# EAGLE design USB_IF_STM_Lpt_v3 (EAGLE 7.1.0)
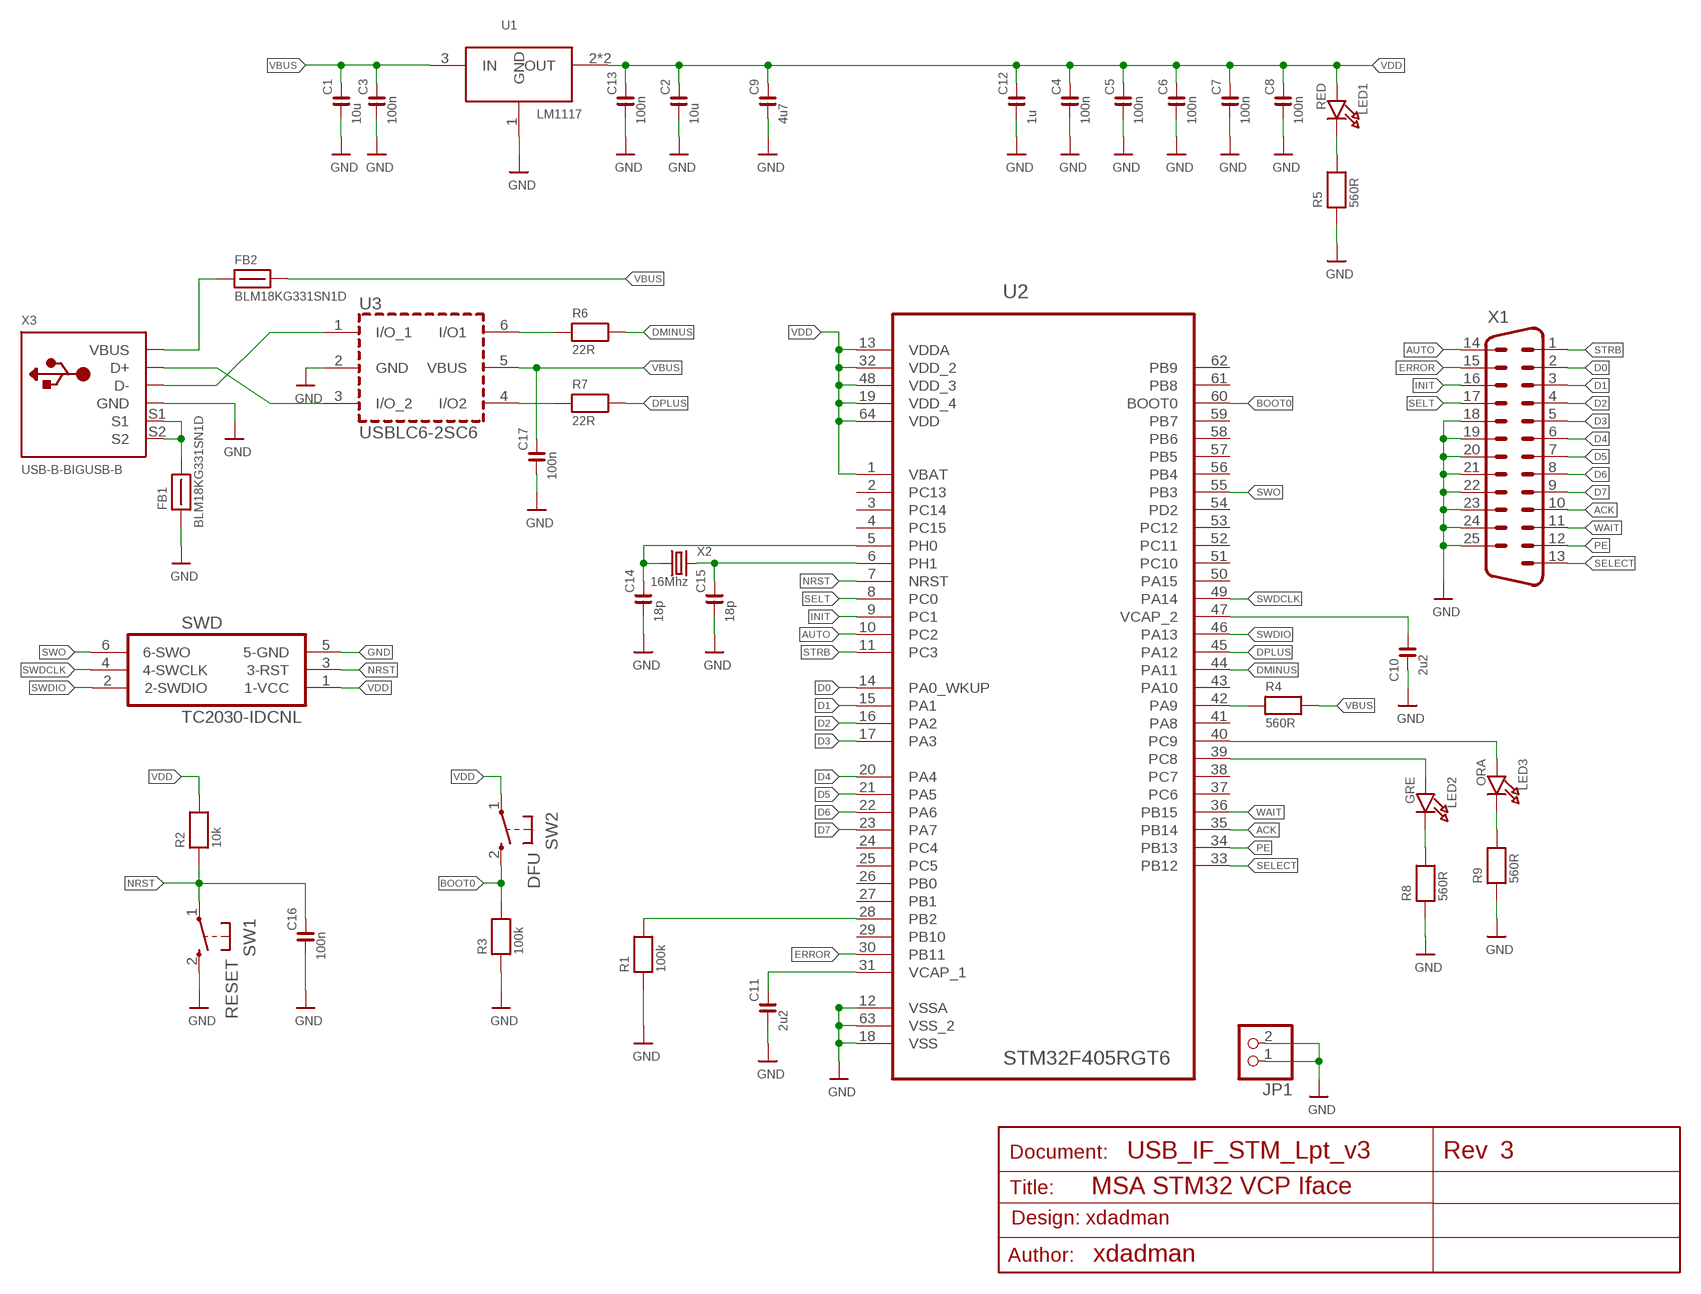
[diagram p0: schematic, sheet 1]

## Parts
C1  10u  CC120610U  [C1206]
C2  10u  CC120610U  [C1206]
C3  100n  CC0603100NF  [C0603]
C4  100n  CC0603100NF  [C0603]
C5  100n  CC0603100NF  [C0603]
C6  100n  CC0603100NF  [C0603]
C7  100n  CC0603100NF  [C0603]
C8  100n  CC0603100NF  [C0603]
C9  4u7  CC06034U7  [C0603]
C10  2u2  CC06032U2  [C0603]
C11  2u2  CC06032U2  [C0603]
C12  1u  CC06031UF  [C0603]
C13  100n  CC0603100NF  [C0603]
C14  18p  CC060318PF  [C0603]
C15  18p  CC060318PF  [C0603]
C16  100n  CC0603100NF  [C0603]
C17  100n  CC0603100NF  [C0603]
FB1  BLM18KG331SN1D  FBEAD0603BLM18KG331SN1D  [R0603]
FB2  BLM18KG331SN1D  FBEAD0603BLM18KG331SN1D  [R0603]
JP1  PINHD-1X2  [1X02]
LED1  RED  LED_0603_RED0603  [CHIPLED_0603]
LED2  GRE  LED_0603_GRE0603  [CHIPLED_0603]
LED3  ORA  LED_0603_YEL0603  [CHIPLED_0603]
R1  100k  R0603100K  [R0603]
R2  10k  R060310K  [0603-MINI]
R3  100k  R0603100K  [R0603]
R4  560R  R0603560R  [R0603]
R5  560R  R0603560R  [R0603]
R6  22R  R060322R  [R0603]
R7  22R  R060322R  [R0603]
R8  560R  R0603560R  [R0603]
R9  560R  R0603560R  [R0603]
SW1  RESET  TACTILE_SWITCH_R6X3  [TACTILE_6X3]
SW2  DFU  TACTILE_SWITCH_R6X3  [TACTILE_6X3]
SWD  TC2030-IDCNL  [TC2030-IDC-NL]
U1  LM1117  [SOT223]
U2  STM32F405RGT6  [QFP50P1200X1200X160-64N]
U3  USBLC6-2SC6  [SOT-23-6L]
X1  M25D  [M25D]
X2  16Mhz  ABM7-16MHZ  [ABRACON_ABM7]
X3  USB-B-BIGUSB-B  [USB-B-PTH]

## Nets
ACK: U2.35(PB14) X1.10
AUTO: U2.10(PC2) X1.14
BOOT0: R3.2 SW2.2 U2.60(BOOT0)
D0: U2.14(PA0_WKUP) X1.2
D1: U2.15(PA1) X1.3
D2: U2.16(PA2) X1.4
D3: U2.17(PA3) X1.5
D4: U2.20(PA4) X1.6
D5: U2.21(PA5) X1.7
D6: U2.22(PA6) X1.8
D7: U2.23(PA7) X1.9
DMINUS: R6.2 U2.44(PA11)
DPLUS: R7.2 U2.45(PA12)
ERROR: U2.30(PB11) X1.15
GND: C1.1 C2.1 C3.1 C4.1 C5.1 C6.1 C7.1 C8.1 C9.1 C10.1 C11.1 C12.1 C13.1 C14.1 C15.1 C16.1 C17.1 FB1.1 JP1.1 JP1.2 R1.1 R3.1 R5.1 R8.1 R9.1 SW1.2 SWD.5(5-GND) U1.1(GND) U2.12(VSSA) U2.18(VSS) U2.63(VSS_2) U3.2(GND) X1.18 X1.19 X1.20 X1.21 X1.22 X1.23 X1.24 X1.25 X3.GND
INIT: U2.9(PC1) X1.16
N$1: R1.2 U2.28(PB2)
N$2: R4.1 U2.42(PA9)
N$3: LED1.C R5.2
N$5: C11.2 U2.31(VCAP_1)
N$6: C15.2 U2.6(PH1) X2.P$2
N$7: C14.2 U2.5(PH0) X2.P$1
N$8: FB1.2 X3.S1 X3.S2
N$9: FB2.1 X3.VBUS
N$10: U3.3(I/O_2) X3.D+
N$11: U3.1(I/O_1) X3.D-
N$12: R6.1 U3.6(I/O1)
N$13: R7.1 U3.4(I/O2)
N$14: C10.2 U2.47(VCAP_2)
N$15: LED2.C R8.2
N$16: LED3.C R9.2
NRST: C16.2 R2.1 SW1.1 SWD.3(3-RST) U2.7(NRST)
PE: U2.34(PB13) X1.12
SELECT: U2.33(PB12) X1.13
SELT: U2.8(PC0) X1.17
STRB: U2.11(PC3) X1.1
SWDCLK: SWD.4(4-SWCLK) U2.49(PA14)
SWDIO: SWD.2(2-SWDIO) U2.46(PA13)
SWO: SWD.6(6-SWO) U2.55(PB3)
VBUS: C1.2 C3.2 C17.2 FB2.2 R4.2 U1.3(IN) U3.5(VBUS)
VDD: C2.2 C4.2 C5.2 C6.2 C7.2 C8.2 C9.2 C12.2 C13.2 LED1.A R2.2 SW2.1 SWD.1(1-VCC) U1.2(OUT) U1.4(OUT) U2.1(VBAT) U2.13(VDDA) U2.19(VDD_4) U2.32(VDD_2) U2.48(VDD_3) U2.64(VDD)
VDD1: LED2.A U2.39(PC8)
VDD2: LED3.A U2.40(PC9)
WAIT: U2.36(PB15) X1.11
Unconnected: U2.2(PC13) U2.3(PC14) U2.4(PC15) U2.24(PC4) U2.25(PC5) U2.26(PB0) U2.27(PB1) U2.29(PB10) U2.37(PC6) U2.38(PC7) U2.41(PA8) U2.43(PA10) U2.50(PA15) U2.51(PC10) U2.52(PC11) U2.53(PC12) U2.54(PD2) U2.56(PB4) U2.57(PB5) U2.58(PB6) U2.59(PB7) U2.61(PB8) U2.62(PB9)

## Notes on the sheet
- 3
- MSA STM32 VCP Iface
- Design: xdadman
- xdadman

## Library data of the parts
C1 C2 = MSA_lib:CC1206: Capacitor ceramic 1206; OC_FARNELL: 1611967
C3-C8 C13 C16 C17 = MSA_lib:CC0603: 0603 Ceramic capacitor; OC_FARNELL: 1759016
C9 = MSA_lib:CC0603: 0603 Ceramic capacitor; OC_FARNELL: 1735527
C10 C11 = MSA_lib:CC0603: 0603 Ceramic capacitor; OC_FARNELL: 1797012
C12 = MSA_lib:CC0603: 0603 Ceramic capacitor; OC_FARNELL: 1845766
C14 C15 = MSA_lib:CC0603: 0603 Ceramic capacitor; OC_FARNELL: 1828908
FB1 FB2 = MSA_lib:FBEAD0603: Ferrite bead; OC_FARNELL: 1781092
JP1 = MSA_lib:PINHD-1X2: PIN HEADER
LED1 = MSA_lib:LED_0603_RED: Chip LED 0603 RED 2ma; OC_FARNELL: 1685068
LED2 = MSA_lib:LED_0603_GRE: Chipled 0603 GREEN 2ma; OC_FARNELL: 1908053
LED3 = MSA_lib:LED_0603_YEL: Chipled 0603 yellow 2ma; OC_FARNELL: 1685069
R1 R3 = MSA_lib:R0603: Resistor 0603; OC_FARNELL: 2332029
R2 = MSA_lib:R0603: Resistor 0603; OC_FARNELL: 9330399
R4 R5 R8 R9 = MSA_lib:R0603: Resistor 0603; OC_FARNELL: 2331724
R6 R7 = MSA_lib:R0603: Resistor 0603; OC_FARNELL: 2331703
SW1 SW2 = MSA_lib:TACTILE_SWITCH_R: Tactile switch RA 6mm; GME_OC: 630-168
SWD = MSA_lib:TC2030-IDC: Tag-Connect In Circuit Programming & Debug Cable 6 Pin http://www.tag-connect.com
U1 = MSA_lib:LM1117: LDO 3.3V LM1117; OC_FARNELL: 2323580
U2 = MSA_lib:STM32F405RGT6: IC, MCU, 32BIT, 1MB FLASH, 64LQFP; MPN: STM32F405RGT6; OC_FARNELL: 2064363; OC_NEWARK: 73T2329; PACKAGE: 64LQFP; SUPPLIER: STMicroelectronics
U3 = MSA_lib:USBLC6-2: VERY LOW CAPACITANCE ESD PROTECTION 2 line Datasheet link <http://www.st.com/web/catalog/sense_power/FM114/CL1137/SC1489/PF93353>; OC_FARNELL: 1269406
X1 = MSA_lib:M25: SUB-D; OC_FARNELL: 1084674
X2 = MSA_lib:ABM7-16MHZ: Crystal 16mhz; OC_FARNELL: 2308713
X3 = MSA_lib:USB-B-BIG; OC_FARNELL: 2112373

## Board
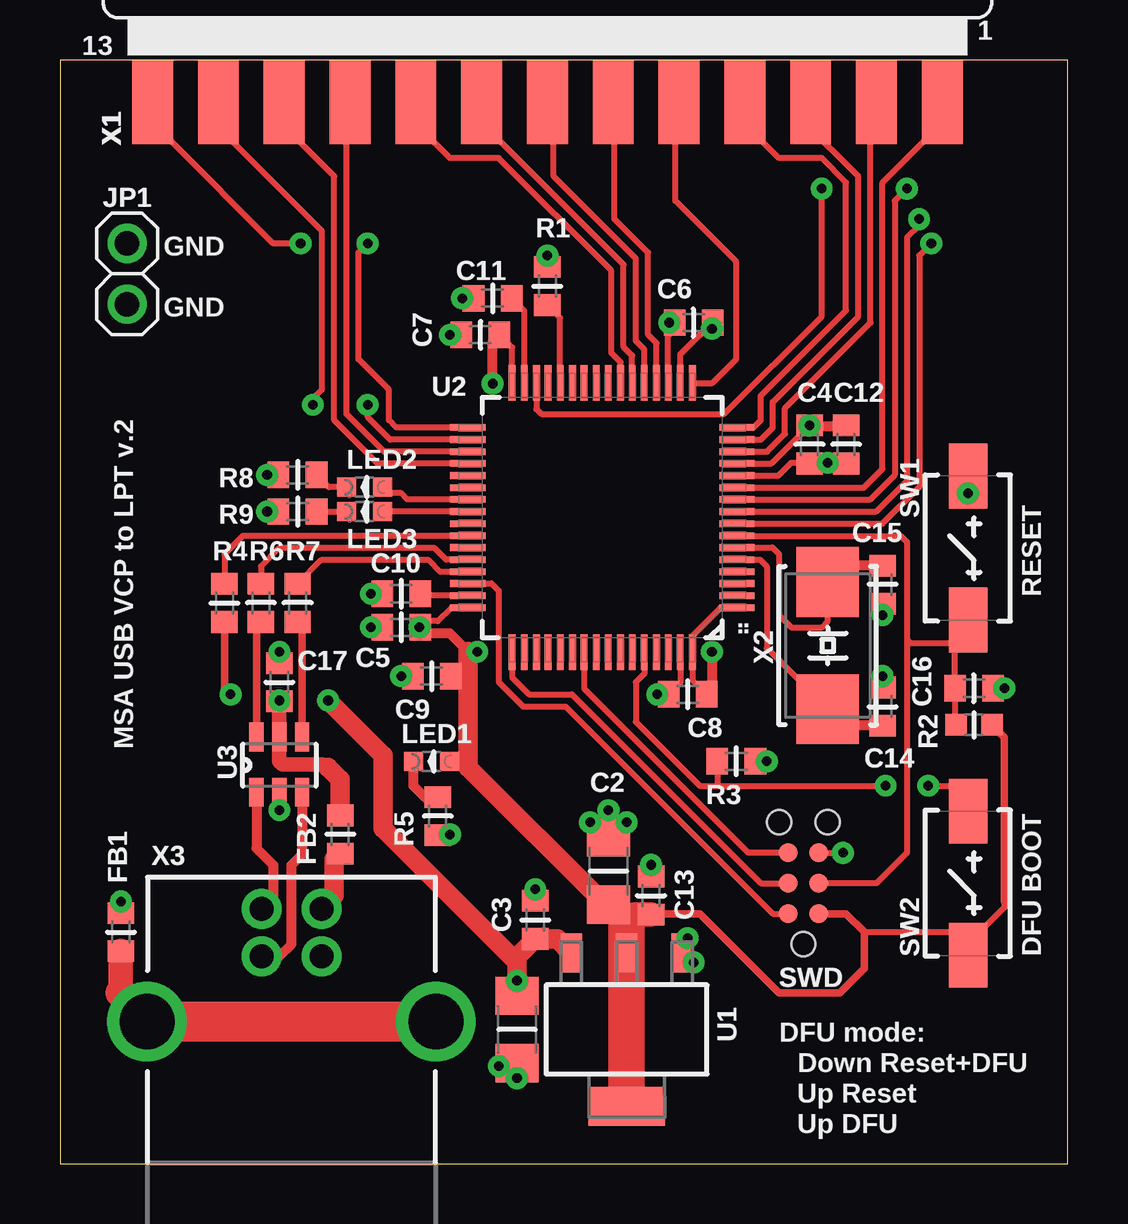
[diagram p1: board, top side]
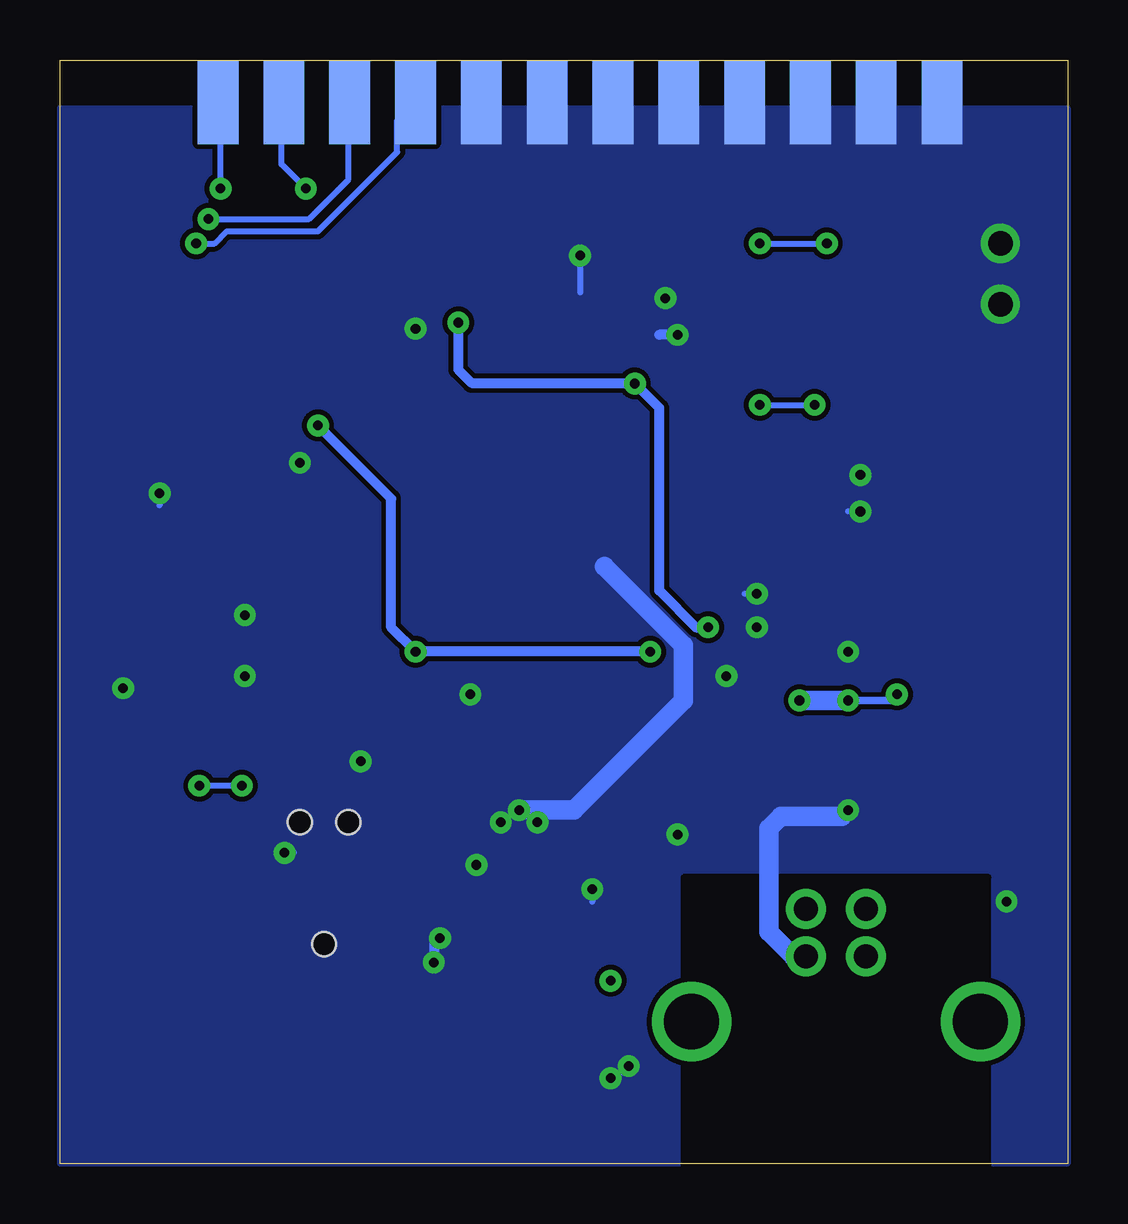
[diagram p2: board, bottom side, seen from below]

Size 42 x 46 mm. Coordinates in mm from the lower left corner, seen from the top.
Outline: 0,0 42,0 42,46 0,46 0,0
Copper layers (1*16): Top 0.035mm / dielectric 1.5mm / Bottom 0.035mm
Design rules "kuba_no_CLR": minimum track width 8mil, minimum drill 15mil, track to track 8mil, track to pad 8mil, pad to pad 8mil, via to via 8mil, smd to smd 8mil, copper to edge 0mil, drill to drill 8mil, minimum pad ring 12mil, minimum via ring 10mil, stop-mask expansion 4mil, vias tented up to drill 0mil, thermal gap 10mil

### Footprints (pad centres in the part's own frame; a part is rotated, then mirrored left to right if it is on the bottom)
C1206 = smd 1.6 x 1.8: 1 -1.4,0; 2 1.4,0
C0603 = smd 0.9 x 1.1: 1 -0.794,0; 2 0.794,0
R0603 = smd 0.9 x 1.1: 1 -0.794,0; 2 0.794,0
1X02 = drill 1.016: 1 -1.27,0; 2 1.27,0
CHIPLED_0603 = smd 0.8 x 0.8: A 0,-0.75; C 0,0.75
0603-MINI = smd 0.9 x 0.9: 1 -0.75,0; 2 0.75,0
TACTILE_6X3 = smd 2.7 x 1.6: 1 -3,0; 2 3,0
TC2030-IDC-NL = smd 0.787 x 0.787: 1 -1.27,-0.635; 2 -1.27,0.635; 3 0,-0.635; 4 0,0.635; 5 1.27,-0.635; 6 1.27,0.635 | hole 1: -2.54,0; 2.54,1.016; 2.54,-1.016
SOT223 = smd 1.626 x 0.889: 1 -3.2,2.311; 2 -3.2,0; 3 -3.2,-2.311 | smd 1.626 x 3.175: 4 3.2,0
QFP50P1200X1200X160-64N = smd 1.473 x 0.279: 1 -5.613,3.759; 2 -5.613,3.251; 3 -5.613,2.743; 4 -5.613,2.261; 5 -5.613,1.753; 6 -5.613,1.245; 7 -5.613,0.762; 8 -5.613,0.254; 9 -5.613,-0.254; 10 -5.613,-0.762; 11 -5.613,-1.245; 12 -5.613,-1.753; 13 -5.613,-2.261; 14 -5.613,-2.743; 15 -5.613,-3.251; 16 -5.613,-3.759; 33 5.613,-3.759; 34 5.613,-3.251; 35 5.613,-2.743; 36 5.613,-2.261; 37 5.613,-1.753; 38 5.613,-1.245; 39 5.613,-0.762; 40 5.613,-0.254; 41 5.613,0.254; 42 5.613,0.762; 43 5.613,1.245; 44 5.613,1.753; 45 5.613,2.261; 46 5.613,2.743; 47 5.613,3.251; 48 5.613,3.759 | smd 0.279 x 1.473: 17 -3.759,-5.613; 18 -3.251,-5.613; 19 -2.743,-5.613; 20 -2.261,-5.613; 21 -1.753,-5.613; 22 -1.245,-5.613; 23 -0.762,-5.613; 24 -0.254,-5.613; 25 0.254,-5.613; 26 0.762,-5.613; 27 1.245,-5.613; 28 1.753,-5.613; 29 2.261,-5.613; 30 2.743,-5.613; 31 3.251,-5.613; 32 3.759,-5.613; 49 3.759,5.613; 50 3.251,5.613; 51 2.743,5.613; 52 2.261,5.613; 53 1.753,5.613; 54 1.245,5.613; 55 0.762,5.613; 56 0.254,5.613; 57 -0.254,5.613; 58 -0.762,5.613; 59 -1.245,5.613; 60 -1.753,5.613; 61 -2.261,5.613; 62 -2.743,5.613; 63 -3.251,5.613; 64 -3.759,5.613
SOT-23-6L = smd 0.6 x 1.2: 1 -0.95,-2.3; 2 0,-2.3; 3 0.95,-2.3; 4 0.95,0; 5 0,0; 6 -0.95,0
M25D = smd 1.7 x 3.5: 1 16.459,-6.045; 2 13.716,-6.045; 3 10.973,-6.045; 4 8.23,-6.045; 5 5.486,-6.045; 6 2.743,-6.045; 7 0,-6.045; 8 -2.743,-6.045; 9 -5.486,-6.045; 10 -8.23,-6.045; 11 -10.973,-6.045; 12 -13.716,-6.045; 13 -16.459,-6.045 | smd 1.7 x 3.5 bottom: 14 15.088,-6.045; 15 12.344,-6.045; 16 9.601,-6.045; 17 6.858,-6.045; 18 4.115,-6.045; 19 1.372,-6.045; 20 -1.372,-6.045; 21 -4.115,-6.045; 22 -6.858,-6.045; 23 -9.601,-6.045; 24 -12.344,-6.045; 25 -15.088,-6.045
ABRACON_ABM7 = smd 2.9 x 2.6: P$1 -2.65,0; P$2 2.65,0
USB-B-PTH = drill 1 pad 1.676: D+ 0,1.25; D- 1.981,1.25; GND 0,-1.25; VBUS 1.981,-1.25 | drill 2.3: S1 -2.718,-6.02; S2 -2.718,6.02

### Placement (x,y rotation side)
C1  19.05,5.59 90 top
C2  22.86,12.19 270 top
C3  19.81,10.16 270 top
C4  31.24,29.97 90 top
C5  14.22,22.35 0 top
C6  26.42,35.05 180 top
C7  17.53,34.54 0 top
C8  26.16,19.56 0 top
C9  15.49,20.32 0 top
C10  14.22,23.75 0 top
C11  18.03,36.07 0 top
C12  32.77,29.97 90 top
C13  24.64,11.18 270 top
C14  34.29,19.05 270 top
C15  34.29,24.13 90 top
C16  38.1,19.81 180 top
C17  9.14,20.07 270 top
FB1  2.54,9.65 270 top
FB2  11.68,13.72 90 top
JP1  2.79,37.08 270 top
LED1  15.49,16.76 90 top
LED2  12.7,28.19 90 top
LED3  12.7,27.18 90 top
R1  20.32,36.58 270 top
R2  38.1,18.29 0 top
R3  28.19,16.76 180 top
R4  6.86,23.37 270 top
R5  15.75,14.48 90 top
R6  8.38,23.37 90 top
R7  9.91,23.37 90 top
R8  9.91,28.7 0 top
R9  9.91,27.18 0 top
SW1  37.85,25.65 90 top
SW2  37.85,11.68 90 top
SWD  30.99,11.68 90 top
U1  23.62,5.59 270 top
U2  22.61,26.92 180 top
U3  9.14,17.78 0 top
X1  20.32,50.29 0 top
X2  32,21.59 90 top
X3  9.65,8.64 90 top

### Tracks (layer width: path | path; a pad name or v marks a point on that pad's centre or on a via)
ACK
  Top 0.254: U2.35 13.51,29.67 11.94,31.24 11.94,44.09 X1.10
AUTO  (via drill 0.4)
  Top 0.254: U2.10 33.78,27.69 34.8,28.7 34.8,40.13 v35.31,40.64
  Bottom 0.254: v35.31,40.64 35.31,44.15 X1.14
BOOT0  (via drill 0.4)
  Top 0.254: 27.43,15.75 26.67,15.75 24,18.41 24,20.07 24.36,20.42 U2.60 | 27.43,15.75 v34.42,15.75 | R3.2 27.4,15.78 27.43,15.75 | v36.2,15.75 37.85,15.75 SW2.2
  Bottom 0.254: v34.42,15.75 v36.2,15.75
D0
  Top 0.254: U2.14 29.47,29.67 30.23,30.42 30.23,31.5 33.78,35.05 33.78,43.99 X1.2
D1
  Top 0.254: U2.15 29.22,30.18 29.72,30.68 29.72,31.75 33.27,35.31 33.27,41.15 30.99,43.43 30.99,44.2 | X1.3 31.24,44.2 30.99,44.2 | 30.99,44.2 30.73,44.45
D2
  Top 0.254: 28.45,44.2 28.55,44.09 28.7,44.09 X1.4 28.5,44.25 28.45,44.2 | U2.16 28.91,30.68 29.21,30.99 29.21,32 32.77,35.56 32.77,40.89 31.75,41.91 29.97,41.91 28.45,43.43 28.45,44.2 | 28.45,44.2 28.45,44.45 28.7,44.7
D3
  Top 0.254: U2.17 27.2,32.54 28.19,33.53 28.19,37.59 25.65,40.13 25.65,44.09 X1.5
D4
  Top 0.254: X1.6 23.11,44.2 23.11,39.37 24.51,37.97 24.51,34.54 24.87,34.19 U2.20
  Top 0.406: 23.37,43.94 X1.6
D5
  Top 0.254: U2.21 24.36,33.93 24,34.29 24,37.72 20.57,41.15 20.57,43.99 X1.7
D6
  Top 0.254: 17.53,44.2 X1.8 17.78,44.04 17.78,43.18 23.5,37.47 23.5,34.04 23.85,33.68 U2.22
D7
  Top 0.254: 14.73,44.15 X1.9 | U2.23 23.37,33.4 22.99,33.78 22.99,37.21 18.29,41.91 16.26,41.91 15.24,42.93 15.24,43.84 X1.9 | 14.99,44.09 X1.9
DMINUS
  Top 0.254: R6.2 8.38,24.89 9.14,25.65 15.62,25.65 16.1,25.17 U2.44
DPLUS
  Top 0.254: R7.2 10.89,25.15 15.37,25.15 15.85,24.66 U2.45
ERROR  (via drill 0.4)
  Top 0.254: U2.30 19.86,31.45 20.07,31.24 27.69,31.24 31.75,35.31 v31.75,40.64
  Bottom 0.254: v31.75,40.64 32.77,41.66 32.77,44.15 X1.15
GND  (via drill 0.4)
  Top 0.254: U2.12 29.95,28.68 30.48,29.21 31.21,29.21 C4.1 31.97,29.18 v32,29.21 32.73,29.21 C12.1 | C2.1 v22.86,14.73 | C10.1 v12.95,23.75 | C5.1 v12.95,22.35 | C9.1 v14.22,20.32 | C1.1 v19.05,3.56 | v18.29,4.06 18.03,4.06 | C3.1 v19.81,11.43 | C13.1 v24.64,12.45 | SWD.5 v32.64,12.95 | 25.35,19.58 C8.1 | C8.1 v24.89,19.56 | C15.1 v34.29,22.86 | C14.1 v34.29,20.32 | U2.18 25.86,33.73 26.67,34.54 26.7,34.54 C6.1 27.21,34.83 v27.18,34.8 | R1.1 v20.32,37.85 | R3.1 v29.46,16.76 | SW1.2 v37.85,27.94 | C16.1 v39.37,19.81 | U2.63 25.86,20.05 C8.1 | R8.1 v8.64,28.7 | R9.1 9.11,27.21 8.89,27.43 v8.64,27.18
  Top 0.305: C17.1 v9.14,21.34
  Top 0.406: U1.1 25.93,9.17 v26.16,9.4 | v26.42,8.38 26.16,8.38 | C7.1 v16.26,34.54 | v9.14,14.73 U3.2 | R5.1 16.22,13.68 v16.26,13.72 | v2.54,10.92 FB1.1 | C11.1 v16.76,36.07
  Bottom 0.254: v12.95,23.75 13.46,23.75 | v12.95,22.35 13.21,22.35 | v14.22,20.32 14.48,20.32 | v19.05,3.56 19.05,3.81 18.29,3.81 18.03,4.06 v18.29,4.06 | v19.81,11.43 19.81,10.92 | v24.64,12.45 24.64,12.19 | v32.64,12.95 32.26,12.95 | v24.89,19.56 25.15,19.56 | v32,29.21 31.75,29.21 | v34.29,22.86 34.29,23.11 | v34.29,20.32 34.29,20.07 | v20.32,37.85 20.32,36.32 | v29.46,16.76 29.21,16.76 | v37.85,27.94 37.85,27.43 | v39.37,19.81 39.12,19.81 | v8.64,28.7 8.89,28.7 | v8.64,27.18 9.14,27.18
  Bottom 0.305: v9.14,21.34 9.14,21.08
  Bottom 0.406: v26.16,9.4 26.42,9.4 v26.42,8.38 | v16.26,34.54 17.02,34.54 | v16.26,13.72 16,13.72 | v16.76,36.07 17.02,36.07
  Bottom 0.813: v22.86,14.73 20.57,14.73 16,19.3 16,21.59 19.3,24.89 | X3.GND 11.43,8.64 12.45,9.65 12.45,13.97 11.94,14.48 9.4,14.48 v9.14,14.73
  other vias: 22.1,14.22 23.62,14.22
  pour Bottom (no thermals): 0,0 42,0 42,44 0,44
INIT  (via drill 0.4)
  Top 0.254: U2.9 34.04,27.18 35.31,28.45 35.31,38.61 35.81,39.12 v35.81,39.37
  Bottom 0.254: v35.81,39.37 31.62,39.37 29.97,41.02 29.97,44.2 X1.16
N$1
  Top 0.254: U2.28 20.85,35.25 R1.2
N$2
  Top 0.254: U2.42 7.62,26.16 6.86,25.4 R4.1
N$3
  Top 0.406: R5.2 15.21,15.27 14.73,15.75 LED1.C
N$4
  cutout Bottom: 3.3,0 3.3,11.94 16,11.94 16,0
N$5
  Top 0.254: U2.31 19.36,35.54 C11.2
N$6
  Top 0.254: U2.6 29.69,25.68 29.97,25.4 29.97,22.86 30.48,22.35 31.75,22.35 32,22.61 X2.P$2
  Top 0.406: C15.2 32.29,24.92 32.26,24.89 32.26,24.49 X2.P$2
N$7
  Top 0.254: U2.5 29.18,25.17 29.46,24.89 29.46,21.48 X2.P$1
  Top 0.406: C14.2 32.69,18.26 X2.P$1
N$8
  Top 1.016: 2.54,7.11 FB1.2
  Top 1.27: X3.S2 3.63,6.02 2.54,7.11
  Top 1.676: X3.S2 X3.S1
N$9
  Top 0.813: X3.VBUS 10.9,10.65 11.43,11.18 11.43,12.67 FB2.1
N$10
  Top 0.406: X3.D+ 9.14,8.64 9.65,9.14 9.65,12.45 10.09,12.89 U3.3
N$11
  Top 0.406: U3.1 8.19,13.14 8.89,12.45 8.89,11.11 X3.D-
N$12
  Top 0.305: U3.6 8.19,22.39 R6.1
N$13
  Top 0.305: U3.4 10.09,22.39 R7.1
N$14
  Top 0.254: U2.47 15.09,23.67 C10.2
N$15
  Top 0.254: LED2.C 11.21,28.19 R8.2
N$16
  Top 0.254: R9.2 LED3.C
NRST
  Top 0.254: U2.7 35.05,26.16 35.31,25.91 35.31,21.84 | 35.31,21.84 35.31,12.95 34.04,11.68 SWD.3 | 37.34,21.68 35.47,21.68 35.31,21.84 | 37.34,21.68 37.31,21.65 C16.2 37.31,18.33 R2.1 | 37.34,21.68 37.34,22.15 SW1.1
PE  (via drill 0.4)
  Top 0.254: X1.12 6.6,44.45 | 6.86,43.99 X1.12 | U2.34 13.77,30.18 12.83,31.11 v12.83,31.62 | v10.54,31.62 10.54,31.88 10.92,32.26 10.92,38.86 6.1,43.69 6.6,44.2 X1.12
  Bottom 0.254: v12.83,31.62 v10.54,31.62
SELECT  (via drill 0.4)
  Top 0.254: U2.33 14.02,30.68 13.72,30.99 13.72,32.26 12.45,33.53 12.45,37.97 v12.83,38.35 | v10.03,38.35 8.89,38.35 4.57,42.67 4.57,43.54 X1.13
  Bottom 0.254: v12.83,38.35 v10.03,38.35
SELT  (via drill 0.4)
  Top 0.254: U2.8 34.29,26.67 35.81,28.19 35.81,37.85 v36.32,38.35
  Bottom 0.254: 27.18,43.43 X1.17 | 27.43,43.99 X1.17 | v36.32,38.35 35.56,38.35 35.05,38.86 31.24,38.86 30.99,39.12 27.94,42.16 27.94,43.48 X1.17 | 26.67,43.43 26.67,43.74 X1.17
STRB
  Top 0.254: U2.11 33.5,28.17 34.29,28.96 34.29,40.89 36.58,43.18 36.58,44.04 X1.1 36.83,44.2
SWDCLK
  Top 0.254: U2.49 18.85,20.27 19.56,19.56 21.34,19.56 29.21,11.68 SWD.4
SWDIO
  Top 0.254: U2.46 17.98,24.18 18.29,23.88 18.29,20.07 19.3,19.05 21.08,19.05 29.72,10.41 SWD.2
SWO
  Top 0.254: SWD.6 28.7,12.95 21.84,19.81 U2.55
VBUS  (via drill 0.4)
  Top 0.305: v7.11,19.56 6.86,19.81 R4.2
  Top 0.61: 11.18,16.51 11.05,16.51 10.92,16.64 9.27,16.64 9.14,16.76 U3.5 C17.2 v9.14,19.3
  Top 0.813: C1.2 v19.05,7.62 19.05,8.38 | 19.05,8.38 19.05,8.6 C3.2 20.73,9.37 U1.3 | FB2.2 11.68,16 11.18,16.51 | v11.18,19.3 13.46,17.02 13.46,13.97 19.05,8.38
  Bottom 0.305: v9.14,19.3 7.37,19.3 v7.11,19.56
  Bottom 0.813: v9.14,19.3 v11.18,19.3
VDD  (via drill 0.4)
  Top 0.254: U2.13 29.66,29.18 C4.2 | U2.19 25.35,34.49 25.4,34.54 v25.4,35.05 C6.2 | 26.96,19.78 C8.2 26.36,20.15 U2.64 26.36,22 27.53,23.16 U2.1 | 33.53,9.65 37.85,9.65 38.1,9.4 | U2.32 18.85,34.02 C7.2 | U2.48 16.31,23.16 15.75,22.61 15.27,22.61 C5.2 | 39.37,10.92 39.37,10.67 38.1,9.4 | 38.1,9.4 38.1,8.94 SW2.1
  Top 0.305: SWD.1 32.77,10.41 33.53,9.65 33.53,8.13 32.51,7.11 29.97,7.11 26.67,10.41 24.16,10.41 24.13,10.38 | 39.37,10.92 39.37,17.77 R2.2
  Top 0.406: 25.4,35.31 v25.4,35.05 | C9.2 16.38,20.32 v17.4,21.34 | v17.4,21.34 17.4,21.46 | C5.2 15.02,22.13 | 24.67,10.41 C13.2 | v18.03,32.51 18.03,34.26 C7.2 | v14.99,22.35 C5.2 | C5.2 15.27,22.1 16.26,22.1 17.02,21.34 v17.4,21.34 | v27.18,21.34 27.18,19.78 C8.2 | 31.24,30.99 C4.2 31.24,30.73 32.73,30.73 C12.2
  Top 0.813: C2.2 22.74,10.79 17.02,16.51 17.02,16.76 | 17.02,16.76 17.02,21.34 | LED1.A 17.02,16.76
  Top 1.016: C2.2 23.62,10.03 23.97,10.38 24.13,10.38 C13.2
  Top 1.524: U1.4 U1.2 23.62,10.03
  Bottom 0.406: v17.4,21.34 v27.18,21.34 | v27.18,21.34 27.18,21.08 | v25.4,35.05 25.4,33.1 24.84,32.54 18.06,32.54 v18.03,32.51 17.02,31.5 17.02,23.88 15.49,22.35 v14.99,22.35 | v27.18,21.34 28.19,22.35 28.19,27.72 C4.2
  other vias: 31.24,30.77
VDD1
  Top 0.254: U2.39 14.48,27.69 14.22,27.94 13.7,27.94 LED2.A
VDD2
  Top 0.254: U2.40 LED3.A
WAIT
  Top 0.254: U2.36 13.23,29.18 11.43,30.99 11.43,41.15 9.4,43.18 9.4,44.2 X1.11

### Text on the board
tPlace: X1 | JP1 | R1 | GND | C11 | C6 | GND | C7 | U2 | C4 | C12 | LED2 | R8 | R9 | SW1 | LED3 | C15 | R4 | R6 | R7 | C10 | RESET | . | . | . | . | C17 | C5 | X2 | C9 | C16 | LED1 | C8 | MSA USB VCP to LPT v.2 | C14 | R2 | U3 | C2 | R3 | R5 | FB1 | X3 | FB2 | C3 | C13 | SW2 | DFU BOOT | SWD | U1 | DFU mode: | Down Reset+DFU | Up Reset | Up DFU